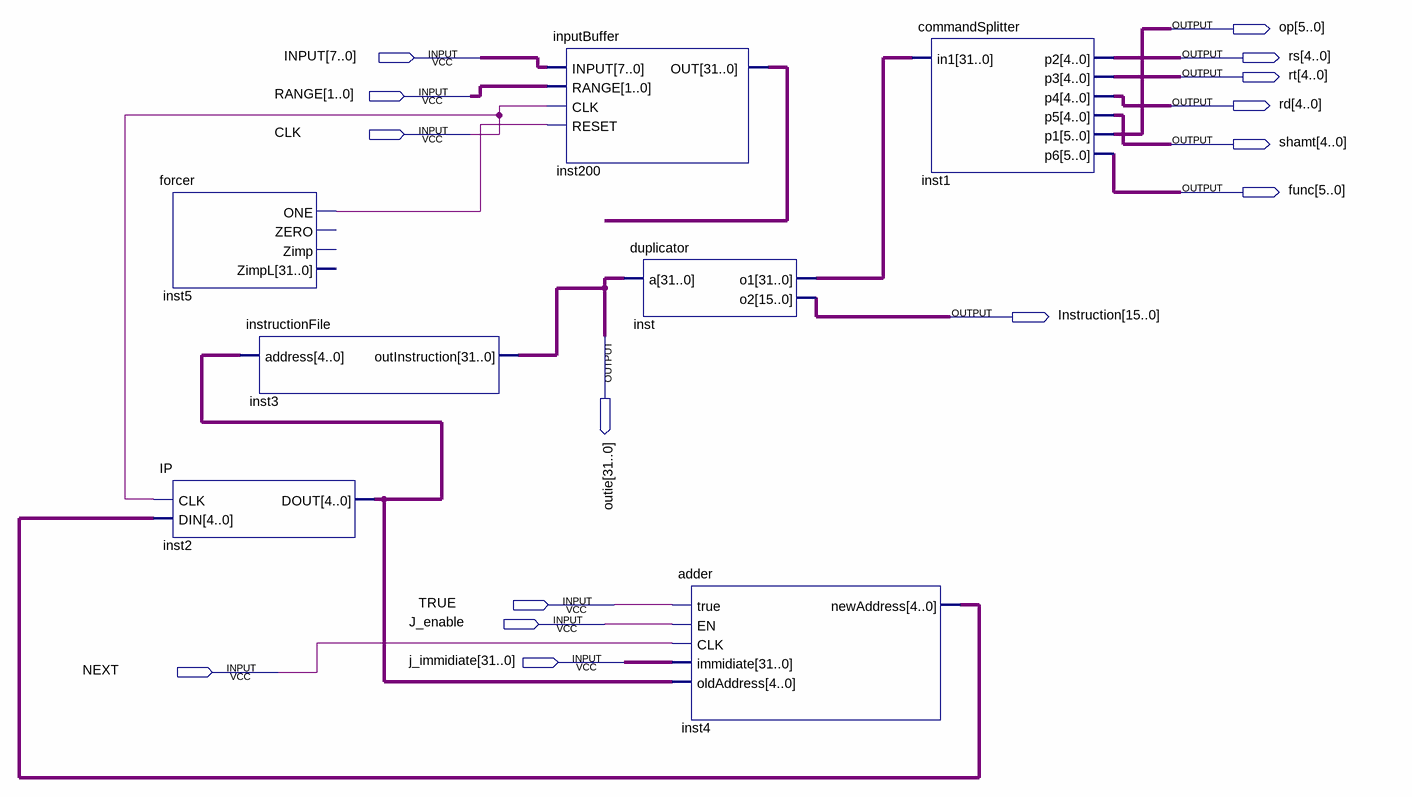
[diagram p0: schematic sheet]
// Quartus schematic r_typeIn.bdf as structural Verilog: 7 symbols, 15 pins
module r_typeIn (
  input  [7:0] INPUT,
  input  [1:0] RANGE,
  input  CLK,
  input  TRUE,
  input  J_enable,
  input  [31:0] j_immidiate,
  input  NEXT,
  output [5:0] op,
  output [4:0] rs,
  output [4:0] rt,
  output [4:0] rd,
  output [4:0] shamt,
  output [5:0] func,
  output [15:0] Instruction,
  output [31:0] outie
);

  wire inst5_one;
  wire [4:0] inst2_dout, inst4_newaddress;
  wire [31:0] inst200_out, inst_o1;

  forcer inst5 (.ONE(inst5_one));  // open: ZERO, Zimp, ZimpL
  IP inst2 (.CLK(CLK), .DIN(inst4_newaddress), .DOUT(inst2_dout));
  instructionFile inst3 (.address(inst2_dout), .outInstruction(outie));
  inputBuffer inst200 (.INPUT(INPUT), .RANGE(RANGE), .CLK(CLK), .RESET(inst5_one), .OUT(inst200_out));
  duplicator inst (.a(outie), .o1(inst_o1), .o2(Instruction));
  adder inst4 (
    .true(TRUE), .EN(J_enable), .CLK(NEXT), .immidiate(j_immidiate), .oldAddress(inst2_dout),
    .newAddress(inst4_newaddress));
  commandSplitter inst1 (.in1(inst_o1), .p2(rs), .p3(rt), .p4(rd), .p5(shamt), .p1(op), .p6(func));
endmodule
